# Altium schematic sheet Sheet1.SchDoc: PANO-SETI  Shutter,  Processor
size B; Organization: Lafleur Designs; Address1: Tom Lafleur; Address2: tom@lafleur.us; Revision: 3c; SheetNumber: 1
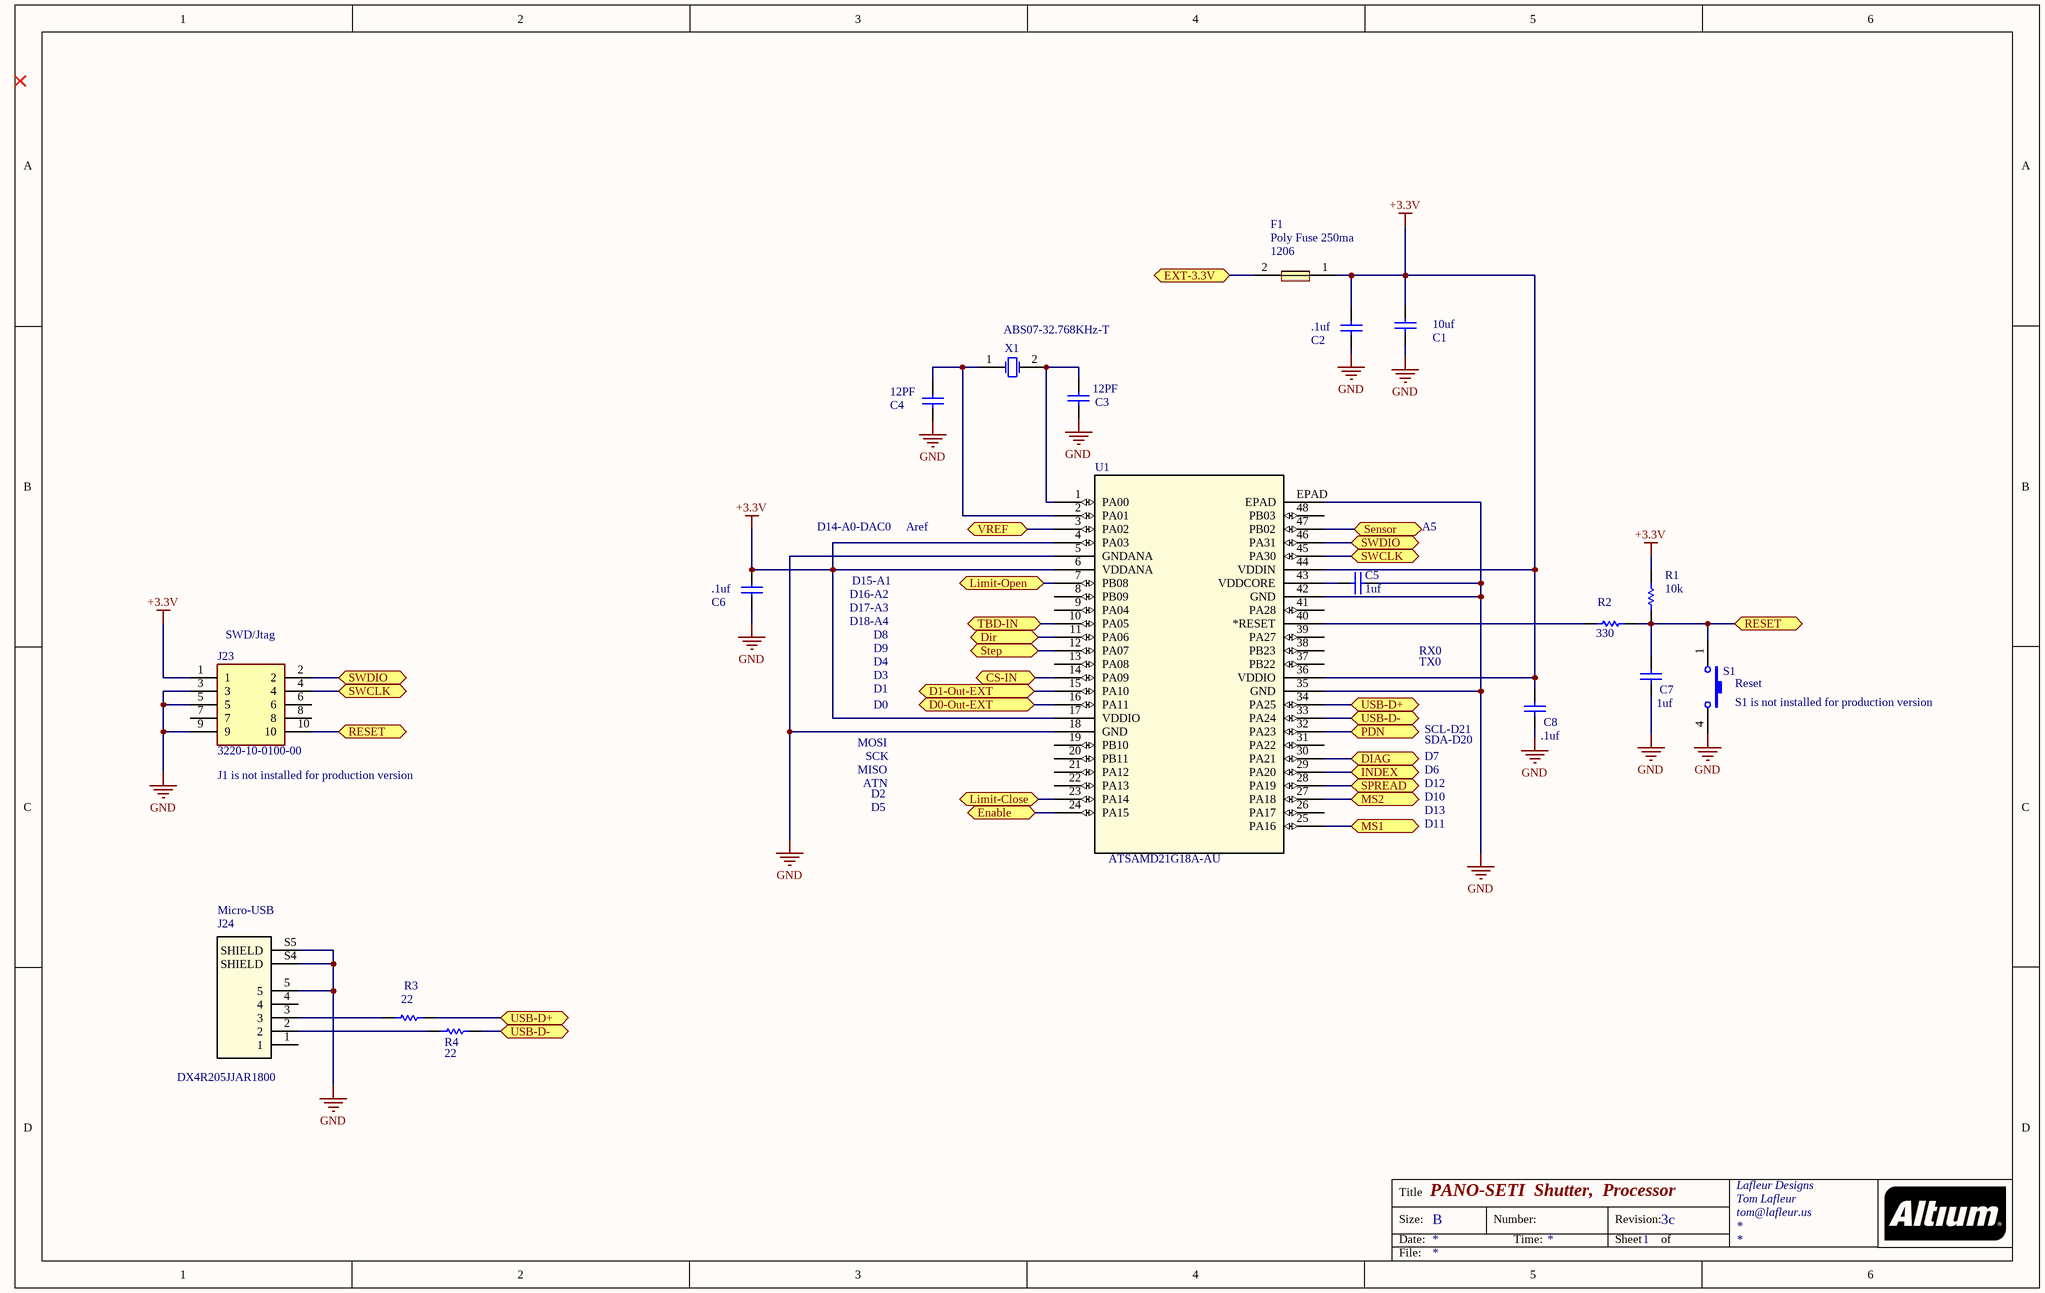
[diagram p0: Sheet1.SchDoc]

## Parts
C1  10uf  [6-0805]
C2  .1uf  [6-0805]
C3  12PF  [6-0805]
C4  12PF  [6-0805]
C5  1uf  [6-0805]
C6  .1uf  [6-0805]
C7  1uf  [6-0805]
C8  .1uf  [6-0805]
F1  Poly Fuse 250ma  [8-1206]
J23  3220-10-0100-00  [SHDR10W41P127_2X5_1265X510X565P]
J24  DX4R205JJAR1800  [*JAE_DX4R205JJAR1800_DX4R205JJAR1800(Primary)]
R1  10k  [6-0805]
R2  330  [6-0805]
R3  22  [6-0805]
R4  22  [6-0805]
S1  Reset  [KMR_2]
U1  ATSAMD21G18A-AU  [TQFP48_7x7MC]
X1  ABS07-32.768KHz-T  [ABRA-ABS07-2_V]

## Ports
CS-IN (bidir), D0-Out-EXT (bidir), D1-Out-EXT (bidir), DIAG (bidir), Dir (bidir), Enable (bidir), EXT-3.3V (bidir), INDEX (bidir), Limit-Close (bidir), Limit-Open (bidir), MS1 (bidir), MS2 (bidir), PDN (bidir), RESET (bidir), Sensor (bidir), SPREAD (bidir), Step (bidir), SWCLK (bidir), SWDIO (bidir), TBD-IN (bidir), USB-D+ (bidir), USB-D- (bidir), VREF (bidir)

## Nets
+3.3V: C1.1 C2.1 C6.1 C8.1 F1.1 J23.1 R1.1 U1.4(PA03) U1.6(VDDANA) U1.17(VDDIO) U1.36(VDDIO) U1.44(VDDIN)
GND: C1.2 C2.2 C3.2 C4.2 C5.2 C6.2 C7.2 C8.2 J23.3 J23.5 J23.9 J24.5 J24.S4(SHIELD) J24.S5(SHIELD) S1.4 U1.5(GNDANA) U1.18(GND) U1.35(GND) U1.42(GND) U1.EPAD
CS-IN: U1.14(PA09) ; port CS-IN
D0-Out-EXT: U1.16(PA11) ; port D0-Out-EXT
D1-Out-EXT: U1.15(PA10) ; port D1-Out-EXT
DIAG: U1.30(PA21) ; port DIAG
Dir: U1.11(PA06) ; port Dir
Enable: U1.24(PA15) ; port Enable
EXT-3.3V: F1.2 ; port EXT-3.3V
INDEX: U1.29(PA20) ; port INDEX
Limit-Close: U1.23(PA14) ; port Limit-Close
Limit-Open: U1.7(PB08) ; port Limit-Open
MS1: U1.25(PA16) ; port MS1
MS2: U1.27(PA18) ; port MS2
PDN: U1.32(PA23) ; port PDN
RESET: C7.1 J23.10 R1.2 R2.2 S1.1 ; port RESET
Sensor: U1.47(PB02) ; port Sensor
SPREAD: U1.28(PA19) ; port SPREAD
Step: U1.12(PA07) ; port Step
SWCLK: J23.4 U1.45(PA30) ; port SWCLK
SWDIO: J23.2 U1.46(PA31) ; port SWDIO
TBD-IN: U1.10(PA05) ; port TBD-IN
USB-D+: R3.2 U1.34(PA25) ; port USB-D+
USB-D-: R4.2 U1.33(PA24) ; port USB-D-
VREF: U1.3(PA02) ; port VREF
NetC3_1: C3.1 U1.1(PA00) X1.2(X2)
NetC4_1: C4.1 U1.2(PA01) X1.1(X1)
NetC5_1: C5.1 U1.43(VDDCORE)
NetJ24_2: J24.2 R4.1
NetJ24_3: J24.3 R3.1
NetR2_1: R2.1 U1.40(*RESET)

Not connected (* = marked no-connect by the designer): J23 6 7 8; J24 1 4; U1 8(PB09) 9(PA04) 13(PA08) 19(PB10) 20(PB11) 21(PA12) 22(PA13) 26(PA17) 31(PA22) 37(PB22) 38(PB23) 39(PA27) 41(PA28) 48(PB03)

## Notes on the sheet
- (near F1) 1206
- D14-A0-DAC0
- Aref
- A5
- (near J23) SWD/Jtag
- D16-A2
- D17-A3
- D18-A4
- D15-A1
- D8
- D9
- D0
- D1
- D3
- D4
- RX0
- TX0
- (near S1) S1 is not installed for production version
- MOSI
- MISO
- SCK
- D6
- D7
- SCL-D21
- SDA-D20
- (near J23) J1 is not installed for production version
- ATN
- D5
- D2
- D11
- D13
- D10
- D12
- (near J24) Micro-USB
- Title
- Size:
- Date:
- B
- Number:
- Time:
- Revision:
- Sheet
- of
- File:

## Library data of the parts
C1-C8 = CAP_2: Capacitor; Fitted: True
F1 = Poly Fuse
J23 = 3220-10-0100-00: Connector; Manufacturer_Name: CNC Tech; Datasheet Link: http://www.cnctech.us/pdfs/3220-XX-0100-00.pdf; Height: 5.65mm; Manufacturer_Part_Number: 3220-10-0100-00
J24 = DX4R205JJAR1800: DX4 series, receptacle, on-board, right-angle standard mount, surface mount; MF: JAE Electronics; SnapEDA_Link: https://www.snapeda.com/parts/DX4R205JJAR1800/JAE%20Electronics/view-part/?ref=snap; Digi-Key_Purchase_URL: https://www.digikey.com/product-detail/en/jae-electronics/DX4R205JJAR1800/670-2677-1-ND/3903237?utm_source=snapeda&utm_medium=aggregator&utm_campaign=symbol; Digi-Key_Part_Number: 670-2677-1-ND; Package: None; MP: DX4R205JJAR1800; Value: *
R1-R4 = ERJ8EN: Precision Thick Film Chip Resistor, 10 Ohm to 2.2M Ohm Range, 1% Tolerance, 1206 Size, 0.125 W; Published: 17-Dec-2003; LatestRevisionDate: 19-Mar-2004; LatestRevisionNote: Silkscreen size reduced.; PackageDocument: Mar-2003; PackageReference: 8-1206; Publisher: Altium Limited; Code_IPC: 3216 [1206]; ComponentLink1Description: Manufacturer Link; ComponentLink1URL: http://www.panasonic.com/industrial/components/resistive_products.htm; ComponentLink2Description: Datasheet; ComponentLink2URL: http://www.panasonic.com/industrial/components/pdf/AOA0000CE2.pdf
S1 = SW-PB: Switch; Published: 24-Mar-1999; LatestRevisionDate: 17-Jul-2002; LatestRevisionNote: Re-released for DXP Platform.; PackageReference: SPST-2; Publisher: Altium Limited
U1 = ATSAMD21G18A-AU: No Description Available; Vendor: Microchip; Built_By: EMA_Molly; Manufacturer_Part_Number: ATSAMD21G18A-AU; Copyright: Copyright (C) 2018 Accelerated Designs. All rights reserved; RefDes: RefDes; Type: DEV; Value: Value
X1 = CMP-0447-00001-2: Crystal, 32.768 kHz, 12.5 pF, -40 to 85 degC, SMD Low Profile 3.2 x 1.5 x 0.9 mm, Tape and Reel; Manufacturer: Abracon; Q Value (Type): 30000; Operation Mode: Flexural Mode (Tuning Fork); Shunt Capacitance (C0): 0.9 to 1.2 pF; Load Capacitance (CL): 12.5 pF; Frequency Tolerance @+25degC: +/- 20 ppm; Drive Level (Type): 0.1 uW; Equivalent Series Resistance (R1): 70 Kohm; Insulation Resistance (Min): 500 Mohm; ComponentLink3URL: http://www.abracon.com/Resonators/ABS07.pdf; PackageDescription: 2-Pin Hand Drawn, Body 3.2x1.5mm, Pitch 2.5mm; Operating Temperature: -40 to 85 degC; ComponentLink2URL: http://www.abracon.com/Resonators/ABS07.pdf; PackageReference: ABS07-2; ComponentLink3Description: Package Specification; ComponentLink1Description: Manufacturer URL; DatasheetVersion: 04.03.13; Mounting Technology: Surface Mount; ComponentLink2Description: Datasheet; ComponentLink1URL: http://www.abracon.com/; PartNumber: ABS07-32.768KHz-T; Packing: Tape and Reel; Frequency: 32.768 kHz